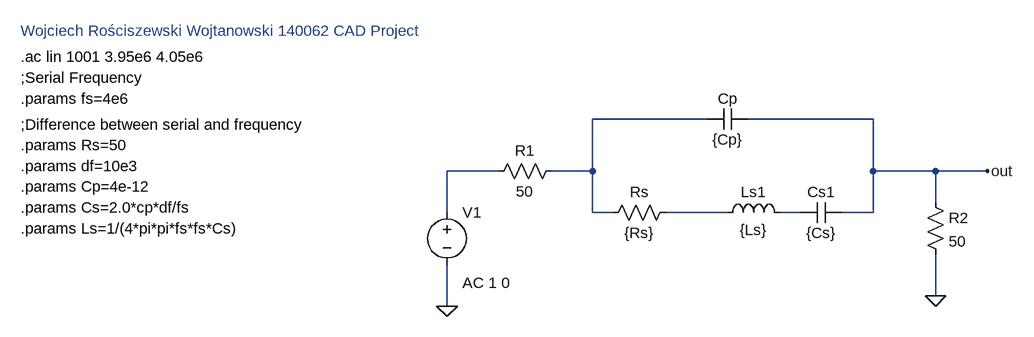
[diagram p0: schematic 2.1 Equivalent Circuit.asc]
2.1 Equivalent Circuit.asc, the LTspice schematic file:
Version 4
SHEET 1 1192 680
WIRE 704 112 528 112
WIRE 960 112 768 112
WIRE 384 192 304 192
WIRE 528 192 528 112
WIRE 528 192 464 192
WIRE 960 192 960 112
WIRE 1056 192 960 192
WIRE 1136 192 1056 192
WIRE 1056 240 1056 192
WIRE 304 256 304 192
WIRE 528 256 528 192
WIRE 560 256 528 256
WIRE 736 256 640 256
WIRE 848 256 816 256
WIRE 960 256 960 192
WIRE 960 256 912 256
WIRE 1056 384 1056 320
WIRE 304 400 304 336
FLAG 304 400 0
FLAG 1136 192 out
FLAG 1056 384 0
SYMBOL res 544 272 R270
WINDOW 0 32 56 VTop 2
WINDOW 3 0 56 VBottom 2
SYMATTR InstName Rs
SYMATTR Value {Rs}
SYMBOL cap 704 128 R270
WINDOW 0 32 32 VTop 2
WINDOW 3 0 32 VBottom 2
SYMATTR InstName Cp
SYMATTR Value {Cp}
SYMBOL cap 848 272 R270
WINDOW 0 32 32 VTop 2
WINDOW 3 0 32 VBottom 2
SYMATTR InstName Cs1
SYMATTR Value {Cs}
SYMBOL ind 720 272 R270
WINDOW 0 32 56 VTop 2
WINDOW 3 5 56 VBottom 2
SYMATTR InstName Ls1
SYMATTR Value {Ls}
SYMBOL voltage 304 240 R0
WINDOW 123 24 124 Left 2
WINDOW 39 0 0 Left 0
SYMATTR Value2 AC 1 0
SYMATTR InstName V1
SYMATTR Value ""
SYMBOL res 480 176 R90
WINDOW 0 0 56 VBottom 2
WINDOW 3 32 56 VTop 2
SYMATTR InstName R1
SYMATTR Value 50
SYMBOL res 1040 224 R0
SYMATTR InstName R2
SYMATTR Value 50
TEXT -352 -24 Left 2 ;Wojciech Rościszewski Wojtanowski 140062 CAD Project
TEXT -352 80 Left 2 !.params fs=4e6
TEXT -352 48 Left 2 !;Serial Frequency
TEXT -352 120 Left 2 !;Difference between serial and frequency
TEXT -352 152 Left 2 !.params Rs=50
TEXT -352 184 Left 2 !.params df=10e3
TEXT -352 216 Left 2 !.params Cp=4e-12
TEXT -352 248 Left 2 !.params Cs=2.0*cp*df/fs
TEXT -352 280 Left 2 !.params Ls=1/(4*pi*pi*fs*fs*Cs)
TEXT -352 16 Left 2 !.ac lin 1001 3.95e6 4.05e6

The netlist it stands for:
* 2.1 Equivalent Circuit.asc
Rs N001 N003 {Rs}
Cp N001 out {Cp}
Cs1 N004 out {Cs}
Ls1 N003 N004 {Ls}
V1 N002 0 AC 1 0
R1 N001 N002 50
R2 out 0 50
* Wojciech Rościszewski Wojtanowski 140062 CAD Project
.params fs=4e6
;Serial Frequency
;Difference between serial and frequency
.params Rs=50
.params df=10e3
.params Cp=4e-12
.params Cs=2.0*cp*df/fs
.params Ls=1/(4*pi*pi*fs*fs*Cs)
.ac lin 1001 3.95e6 4.05e6
.backanno
.end